# Altium schematic sheet LED.SchDoc
size A4
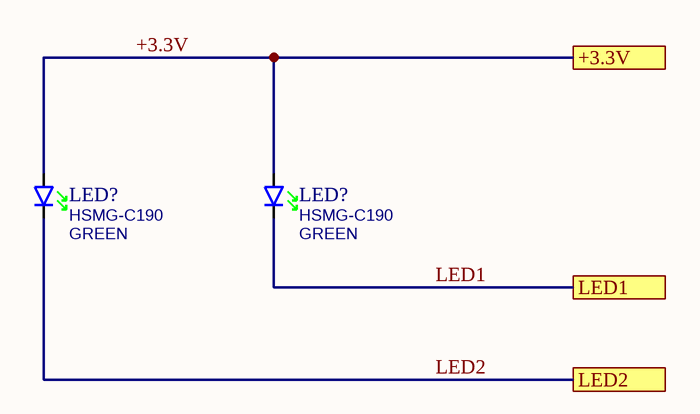
[diagram p0: LED.SchDoc]

## Parts
(Parts that share a designator on the sheet are numbered #1, #2 ... from top to bottom, then left to right.)
LED?#1  Manufacturer Part No.: HSMG-C190  Color: GREEN  [LEDC1608X80N_G]  (hidden comment: LED)
LED?#2  Manufacturer Part No.: HSMG-C190  Color: GREEN  [LEDC1608X80N_G]  (hidden comment: LED)

## Ports
+3.3V, LED1, LED2

## Nets
+3.3V: LED?#1.2(A) LED?#2.2(A) ; port +3.3V
LED1: LED?#2.1(K) ; port LED1
LED2: LED?#1.1(K) ; port LED2

## Library data of the parts
LED?#1 LED?#2 = LED-Avago-HSMG-C190_Green: Surface mount LED green 20mA; Manufacturer Name: Avago; Part Number: LED-Avago-HSMG-C190_Green; ManufacturerPartNumber: LED-Avago-HSMG-C190_Green